# Altium schematic sheet Morpheus_MEM.SchDoc: Storage Sub-board
size Letter; CompanyName: Hello Inc.; DrawnBy: John Kelley; Organization: Hello Inc.; Revision: EVT2; SheetNumber: 7; SheetTotal: 8
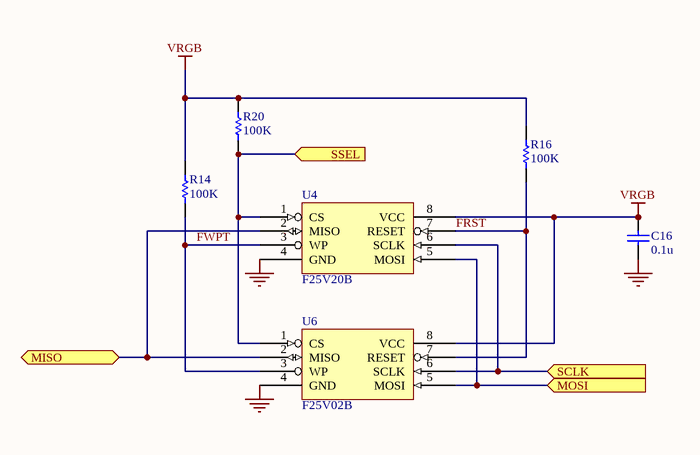
[diagram p0: Morpheus_MEM.SchDoc]

## Parts
C16  0.1u  [CAP0402]
R14  100K  [RES0402]
R16  100K  [RES0402]
R20  100K  [RES0402]
U4  F25V20B  [DFN127P600x500x80-8N]
U6  F25V02B  [DFN95P5000x4500x80-8N]

## Ports
MISO, MOSI (in), SCLK (in), SSEL (in)

## Nets
GND: C16.1 U4.4(GND) U6.4(GND)
VRGB: C16.2 R14.2 R16.2 R20.2 U4.8(VCC) U6.8(VCC)
FRST: R16.1 U4.7(RESET) U6.7(RESET)
FWPT: R14.1 U4.3(WP) U6.3(WP)
MISO: U4.2(MISO) U6.2(MISO) ; port MISO
MOSI: U4.5(MOSI) U6.5(MOSI) ; port MOSI
SCLK: U4.6(SCLK) U6.6(SCLK) ; port SCLK
SSEL: R20.1 U4.1(CS) U6.1(CS) ; port SSEL

## Notes on the sheet
- TITLE
- DATE
- DRAWN BY
- REV
- SHEET
- OF

## Library data of the parts
C16 = C_0.1u_10_50_X7R_0402: Chip capacitor; Vendor: Taiyo Yuden; PN: UMK105B7104KV-FR; Tolerance: 10%; Voltage: 50V; Temp: X7R; Value: 0.1u; Size: 0402
R14 R16 R20 = R_100K_5_0.1_0402: Chip Resistor; Vendor: Panasonic; Tolerance: 5 %; Power: 0.1 W; PN: ERJ-2GEJ104X; Model: *; Value: 100K; Size: 0402
U4 = FM25V20B: Cypress SPI FRAM 256Kx8
U6 = FM25V02B: Cypress SPI FRAM 32Kx8